# EAGLE design BigEasyDriver (EAGLE 7.7.0)
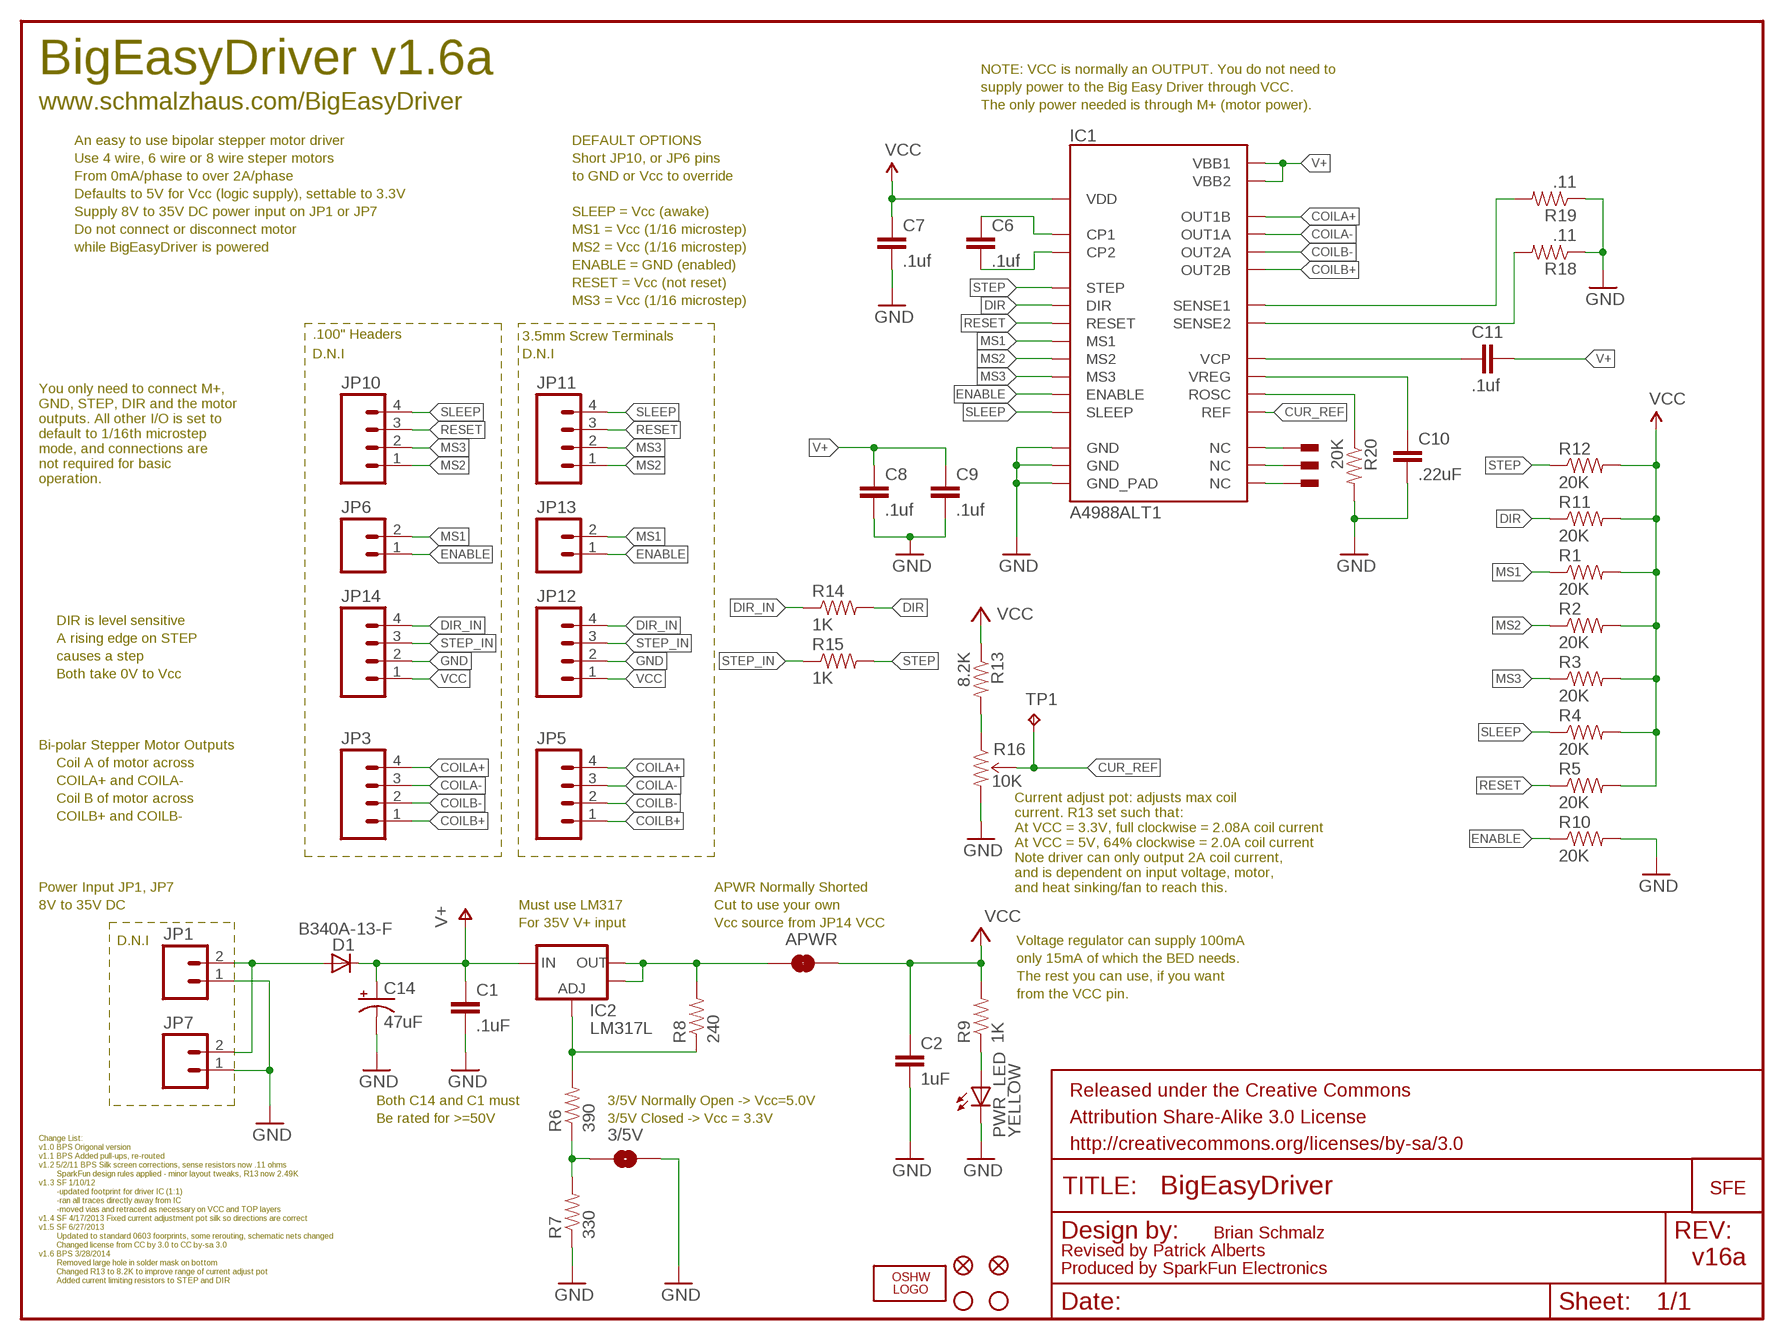
[diagram p0: schematic, sheet 1]

## Parts
3/5V  SOLDERJUMPERNO  [SJ_2S-NO]
APWR  SOLDERJUMPERTRACE  [SJ_2S-TRACE]
C1  .1uF  0.1UF-100V-10%(0603)  [0603-CAP]
C2  1uF  1.0UF-16V-10%(0603)  [0603-CAP]
C6  .1uf  0.1UF-100V-10%(0603)  [0603-CAP]
C7  .1uf  0.1UF-100V-10%(0603)  [0603-CAP]
C8  .1uf  0.1UF-100V-10%(0603)  [0603-CAP]
C9  .1uf  0.1UF-100V-10%(0603)  [0603-CAP]
C10  .22uF  0.22UF50V-20%,+80%(0603)  [0603-CAP]
C11  .1uf  0.1UF-100V-10%(0603)  [0603-CAP]
C14  47uF  47UF-50V-20%(ELECT)  [PANASONIC_D]
D1  B340A-13-F  DIODE-DO-214AC  [DO-214AC]
FID1  FIDUCIAL1X2  [FIDUCIAL-1X2]
FID2  FIDUCIAL1X2  [FIDUCIAL-1X2]
FRAME1  FRAME-LETTER  [CREATIVE_COMMONS]
IC1  A4988ALT1  [QFN-28-5MM_ALT1]
IC2  LM317L  SPARKFUN03_30_09_V_REG_317SOT89SOT89  [SCHMALZHAUS_SOT89]
JP1  M02PTH  [1X02]
JP3  M04PTH  [1X04]
JP5  M04SCREW_LOCK  [SCREWTERMINAL-3.5MM-4_LOCK]
JP6  M02PTH  [1X02]
JP7  M023.5MM_LOCK  [SCREWTERMINAL-3.5MM-2_LOCK]
JP8  STAND-OFF  [STAND-OFF]
JP9  STAND-OFF  [STAND-OFF]
JP10  M04PTH  [1X04]
JP11  M04SCREW_LOCK  [SCREWTERMINAL-3.5MM-4_LOCK]
JP12  M04SCREW_LOCK  [SCREWTERMINAL-3.5MM-4_LOCK]
JP13  M023.5MM_LOCK  [SCREWTERMINAL-3.5MM-2_LOCK]
JP14  M04PTH  [1X04]
LOGO1  OSHW_LOGO_FILLX0100-NT  [OSHW_FILLX100_NOTEXT]
PWR_LED  YELLOW  LED0603  [LED-0603]
R1  20K  20KOHM1/10W5%(0603)  [0603-RES]
R2  20K  20KOHM1/10W5%(0603)  [0603-RES]
R3  20K  20KOHM1/10W5%(0603)  [0603-RES]
R4  20K  20KOHM1/10W5%(0603)  [0603-RES]
R5  20K  20KOHM1/10W5%(0603)  [0603-RES]
R6  390  390OHM1/10W1%(0603)  [0603-RES]
R7  330  330OHM1/10W1%(0603)  [0603-RES]
R8  240  240OHM1/10W1%(0603)  [0603-RES]
R9  1K  1KOHM1/10W1%(0603)  [0603-RES]
R10  20K  20KOHM1/10W5%(0603)  [0603-RES]
R11  20K  20KOHM1/10W5%(0603)  [0603-RES]
R12  20K  20KOHM1/10W5%(0603)  [0603-RES]
R13  8.2K  8.2KOHM-1/10W-5%(0603)  [0603-RES]
R14  1K  1KOHM1/10W1%(0603)  [0603-RES]
R15  1K  1KOHM1/10W1%(0603)  [0603-RES]
R16  10K  TRIMPOT3MM-2  [TRIMPOT-3MM-2]
R18  .11  0.11OHM1/2W1%(2010)  [R2010]
R19  .11  0.11OHM1/2W1%(2010)  [R2010]
R20  20K  20KOHM1/10W5%(0603)  [0603-RES]
TP1  TPPAD1-13  [P1-13]
U$2  LOGO-SFENEW  [SFE-NEW-WEBLOGO]
U$3  PAD  [PAD-0.008]
U$4  PAD  [PAD-0.008]
U$5  PAD  [PAD-0.008]

## Nets
5V_ALT: APWR.1 IC2.OUT IC2.OUT@1(OUT) R8.2
COILA+: IC1.P$21(OUT1B) JP3.4 JP5.4
COILA-: IC1.P$24(OUT1A) JP3.3 JP5.3
COILB+: IC1.P$1(OUT2B) JP3.1 JP5.1
COILB-: IC1.P$26(OUT2A) JP3.2 JP5.2
CUR_REF: IC1.P$17(REF) R16.2(WIPER) TP1.TP
DIR: IC1.P$19(DIR) R11.1 R14.2
DIR_IN: JP12.4 JP14.4 R14.1
ENABLE: IC1.P$2(ENABLE) JP6.1 JP13.1 R10.1
GND: 3/5V.2 C1.2 C2.2 C7.2 C8.2 C9.2 C10.2 C14.- IC1.P$3(GND) IC1.P$18(GND) IC1.P$29(GND_PAD) JP1.1 JP7.1 JP12.2 JP14.2 PWR_LED.C R7.1 R10.2 R16.3(CW) R18.1 R19.1 R20.2
MS1: IC1.P$9(MS1) JP6.2 JP13.2 R1.1
MS2: IC1.P$10(MS2) JP10.1 JP11.1 R2.1
MS3: IC1.P$11(MS3) JP10.2 JP11.2 R3.1
N$1: D1.A JP1.2 JP7.2
N$2: PWR_LED.A R9.1
N$3: R13.2 R16.1(CCW)
N$4: 3/5V.1 R6.1 R7.2
N$5: IC1.P$7(NC) U$3.P$1
N$6: IC2.ADJ R6.2 R8.1
N$7: IC1.P$20(NC) U$4.P$1
N$8: C6.1 IC1.P$4(CP1)
N$9: C6.2 IC1.P$5(CP2)
N$10: IC1.P$25(NC) U$5.P$1
N$19: IC1.P$13(ROSC) R20.1
N$20: C10.1 IC1.P$8(VREG)
N$21: C11.1 IC1.P$6(VCP)
N$31: IC1.P$27(SENSE2) R18.2
N$32: IC1.P$23(SENSE1) R19.2
RESET: IC1.P$12(RESET) JP10.3 JP11.3 R5.1
SLEEP: IC1.P$14(SLEEP) JP10.4 JP11.4 R4.1
STEP: IC1.P$16(STEP) R12.1 R15.2
STEP_IN: JP12.3 JP14.3 R15.1
V+: C1.1 C8.1 C9.1 C11.2 C14.+ D1.C IC1.P$22(VBB1) IC1.P$28(VBB2) IC2.IN
VCC: APWR.2 C2.1 C7.1 IC1.P$15(VDD) JP12.1 JP14.1 R1.2 R2.2 R3.2 R4.2 R5.2 R9.2 R11.2 R12.2 R13.1

## Notes on the sheet
- BigEasyDriver v1.6a | NOTE: VCC is normally an OUTPUT. You do not need to
- supply power to the Big Easy Driver through VCC.
- www.schmalzhaus.com/BigEasyDriver | The only power needed is through M+ (motor power).
- An easy to use bipolar stepper motor driver | DEFAULT OPTIONS
- Use 4 wire, 6 wire or 8 wire steper motors | Short JP10, or JP6 pins
- From 0mA/phase to over 2A/phase | to GND or Vcc to override
- Defaults to 5V for Vcc (logic supply), settable to 3.3V
- Supply 8V to 35V DC power input on JP1 or JP7 | SLEEP = Vcc (awake)
- Do not connect or disconnect motor | MS1 = Vcc (1/16 microstep)
- while BigEasyDriver is powered | MS2 = Vcc (1/16 microstep)
- ENABLE = GND (enabled)
- RESET = Vcc (not reset)
- MS3 = Vcc (1/16 microstep)
- .100" Headers | 3.5mm Screw Terminals
- D.N.I | D.N.I
- You only need to connect M+, 
  GND, STEP, DIR and the motor 
  outputs. All other I/O is set to 
  default to 1/16th microstep 
  mode, and connections are 
  not required for basic 
  operation.
- DIR is level sensitive
- A rising edge on STEP
- causes a step
- Both take 0V to Vcc
- Bi-polar Stepper Motor Outputs
- Coil A of motor across
- COILA+ and COILA-
- Coil B of motor across
- COILB+ and COILB-
- Power Input JP1, JP7 | APWR Normally Shorted
- Current adjust pot: adjusts max coil
  current. R13 set such that:
  At VCC = 3.3V, full clockwise = 2.08A coil current
  At VCC = 5V, 64% clockwise = 2.0A coil current
  Note driver can only output 2A coil current,
  and is dependent on input voltage, motor,
  and heat sinking/fan to reach this.
- 8V to 35V DC | Must use LM317 | Cut to use your own
- For 35V V+ input | Vcc source from JP14 VCC
- D.N.I | Voltage regulator can supply 100mA
- only 15mA of which the BED needs.
- The rest you can use, if you want
- from the VCC pin.
- Both C14 and C1 must | 3/5V Normally Open -> Vcc=5.0V
- Be rated for >=50V | 3/5V Closed -> Vcc = 3.3V
- Change List:
- v1.0 BPS Origonal version
- v1.1 BPS Added pull-ups, re-routed
- v1.2 5/2/11 BPS Silk screen corrections, sense resistors now .11 ohms
- SparkFun design rules applied - minor layout tweaks, R13 now 2.49K
- v1.3 SF 1/10/12
- -updated footprint for driver IC (1:1)
- -ran all traces directly away from IC
- -moved vias and retraced as necessary on VCC and TOP layers
- v1.4 SF 4/17/2013 Fixed current adjustment pot silk so directions are correct
- v1.5 SF 6/27/2013
- Updated to standard 0603 foorprints, some rerouting, schematic nets changed | Brian Schmalz
- Changed license from CC by 3.0 to CC by-sa 3.0
- v1.6 BPS 3/28/2014 | Revised by Patrick Alberts
- Removed large hole in solder mask on bottom | v16a
- Changed R13 to 8.2K to improve range of current adjust pot | Produced by SparkFun Electronics
- Added current limiting resistors to STEP and DIR

## Library data of the parts
3/5V APWR = SparkFun03_30_09:SOLDERJUMPER: Solder Jumper Standard SMD solder jumper. Used to automate production. Two varients : Normally Open and Normally Closed are the same, but have different paste layers. NC will have a large amount of paste and should jumper during reflow.
C1 C6-C9 C11 = SparkFun-Capacitors:0.1UF-100V-10%(0603): CAP-08390; PROD_ID: CAP-08390; VALUE: 0.1uF
C2 = SparkFun-Capacitors:1.0UF-16V-10%(0603): CAP-00868; PROD_ID: CAP-00868; VALUE: 1.0uF
C10 = SparkFun-Capacitors:0.22UF50V-20%,+80%(0603): CAP-09885; PROD_ID: CAP-09885; VALUE: 0.22uF
C14 = SparkFun-Capacitors:47UF-50V-20%(ELECT): CAP-10547; PROD_ID: CAP-10547
D1 = diode:DIODE-: DIODE
FID1 FID2 = SparkFun-Aesthetics:FIDUCIAL: Fiducial Alignment Points Various fiducial points for machine vision alignment.
FRAME1 = SparkFun-Aesthetics:FRAME-LETTER: Schematic Frame Standard 8.5x11 US Letter frame
IC1 = SparkFun-PowerIC:A4988: DMOS Microstepping Driver with Translator; PROD_ID: IC-11483
IC2 = BigEasyDriver_v11:SPARKFUN03_30_09_V_REG_317: Voltage Regulator Standard LM317 adjustable voltage regulator. AOI (Adjust Output Input). Google LM317 Calculator' for easy to use app to get the two resistor values needed. 240/720 for 5V output. 240/390 for 3.3V output. Spark Fun Electronics SKU : COM-00527'
JP1 JP6 = SparkFun:M02: Header 2 Standard 2-pin 0.1" header. Use with straight break away headers (SKU : PRT-00116), right angle break away headers (PRT-00553), swiss pins (PRT-00743), machine pins (PRT-00117), and female headers (PRT-00115). Molex polarized connector foot print use with SKU : PRT-08233 with associated crimp pins and housings.
JP3 JP10 JP14 = SparkFun:M04: Header 4 Standard 4-pin 0.1" header. Use with straight break away headers (SKU : PRT-00116), right angle break away headers (PRT-00553), swiss pins (PRT-00743), machine pins (PRT-00117), and female headers (PRT-00115). Molex polarized connector foot print use with SKU : PRT-08231 with associated ...
JP5 JP11 JP12 = BigEasyDriver_v11:M04: Header 4 Standard 4-pin 0.1" header. Use with straight break away headers (SKU : PRT-00116), right angle break away headers (PRT-00553), swiss pins (PRT-00743), machine pins (PRT-00117), and female headers (PRT-00115). Molex polarized connector foot print use with SKU : PRT-08231 with associated ...
JP7 JP13 = BigEasyDriver_v11:M02: Header 2 Standard 2-pin 0.1" header. Use with straight break away headers (SKU : PRT-00116), right angle break away headers (PRT-00553), swiss pins (PRT-00743), machine pins (PRT-00117), and female headers (PRT-00115). Molex polarized connector foot print use with SKU : PRT-08233 with associated crimp pins and housings.
JP8 JP9 = SparkFun-7-28-09:STAND-OFF: Stand Off This is the mechanical footprint for a #4 phillips button head screw. Use the keepout ring to avoid running the screw head into surrounding components. SKU : PRT-00447
LOGO1 = OSHW:OSHW_LOGO_FILL
PWR_LED = SparkFun03_30_09:LED: LEDs Standard schematic elements and footprints for 5mm, 3mm, 1206, and 0603 sized LEDs. 5mm - Spark Fun Electronics SKU : COM-00529 (and others)
R1-R5 R10-R12 R20 = SparkFun-Resistors:20KOHM1/10W5%(0603): RES-09231; PROD_ID: RES-09231
R6 = SparkFun-Resistors:390OHM1/10W1%(0603): RES-07864; PROD_ID: RES-07864
R7 = SparkFun-Resistors:330OHM1/10W1%(0603): RES-00818; PROD_ID: RES-00818
R8 = SparkFun-Resistors:240OHM1/10W1%(0603): RES-07849; PROD_ID: RES-07849
R9 R14 R15 = SparkFun-Resistors:1KOHM1/10W1%(0603): RES-07856; PROD_ID: RES-07856
R13 = SparkFun-Resistors:8.2KOHM-1/10W-5%(0603): RES-10646; PROD_ID: RES-10646
R16 = SparkFun-Electromechanical:TRIMPOT: Various small potentiometers for "set-and-forget" applications
R18 R19 = SparkFun-Resistors:0.11OHM1/2W1%(2010): RES-08354; PROD_ID: RES-08354
TP1 = testpad:TP: Test pad
U$2 = SparkFun:LOGO-SFE: Spark Fun Electronics PCB Logo This is the standard Spark Fun Electronics PCB logo.
U$3-U$5 = Testing:PAD

## Board
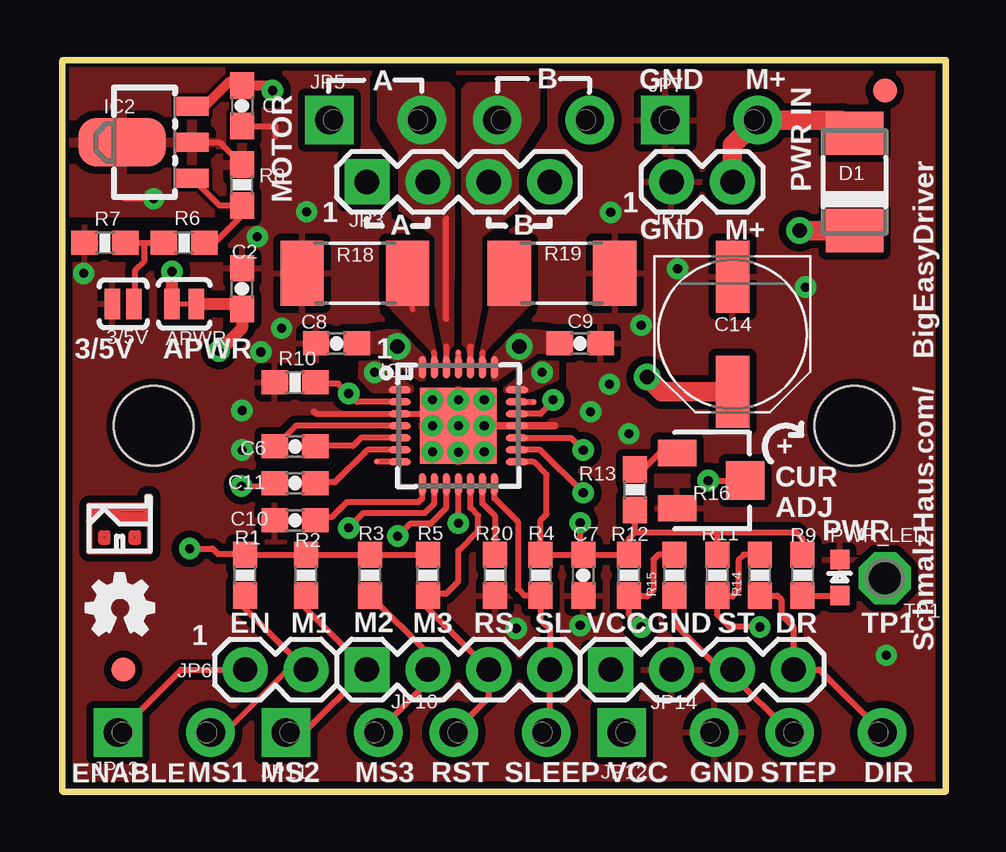
[diagram p1: board, top side]
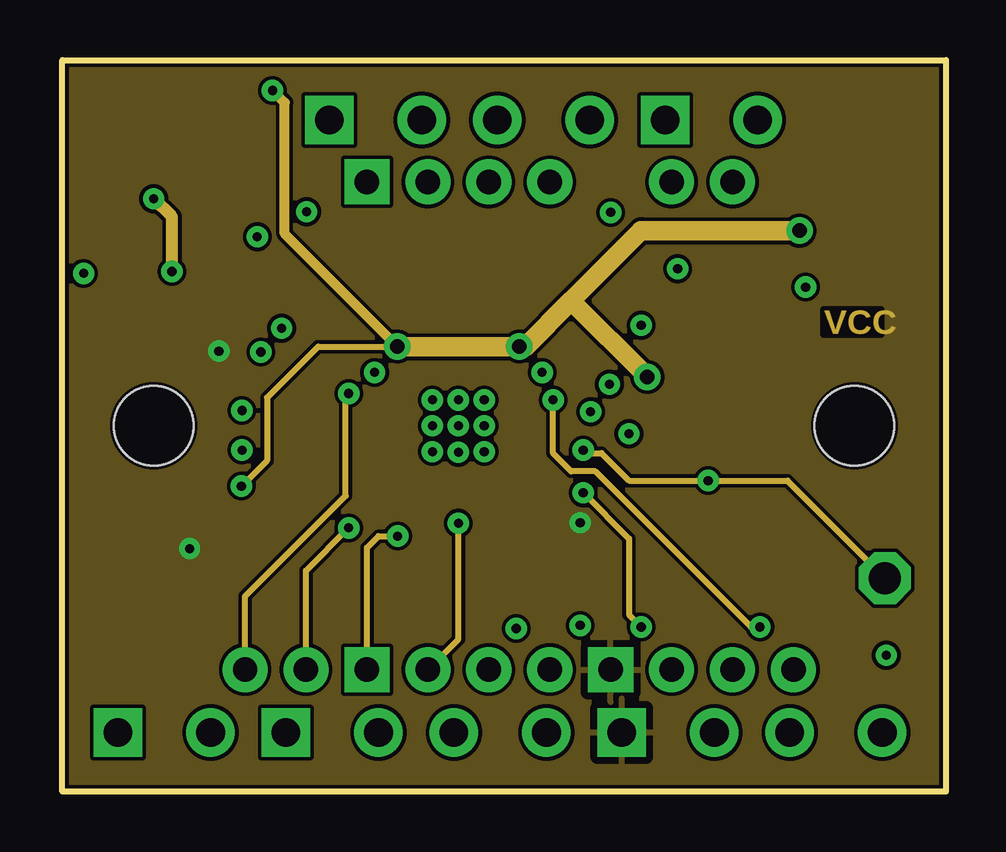
[diagram p2: board, inner layer VCC]
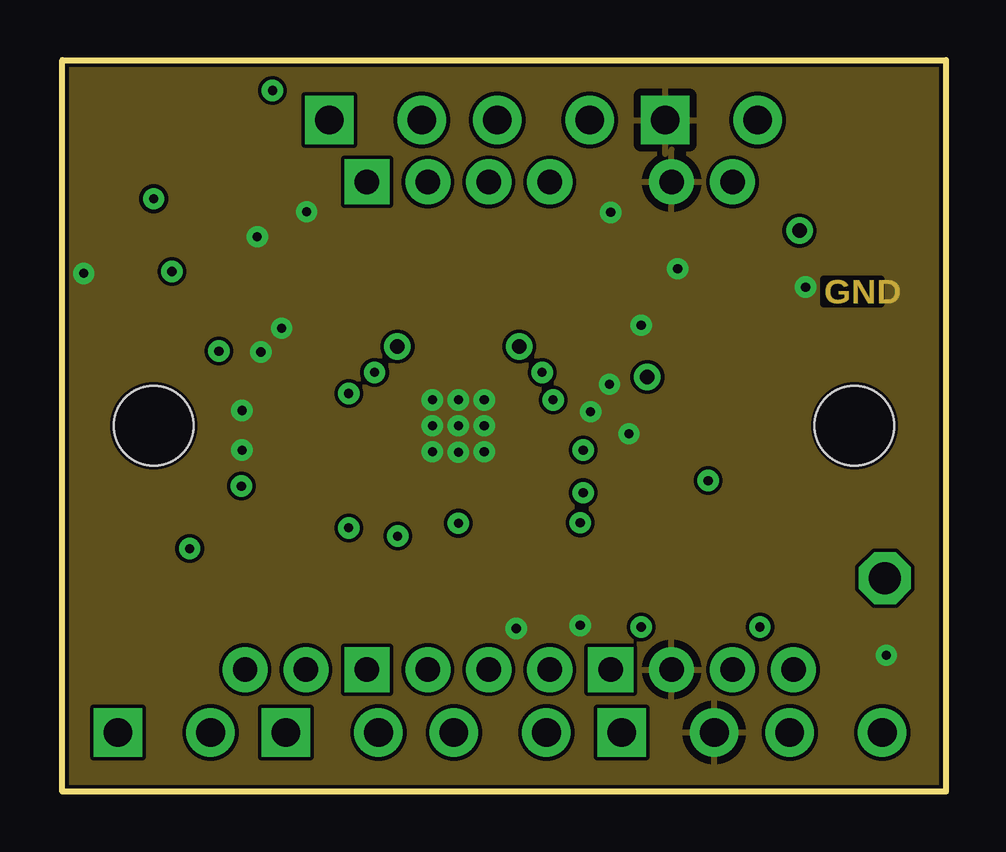
[diagram p3: board, inner layer GND]
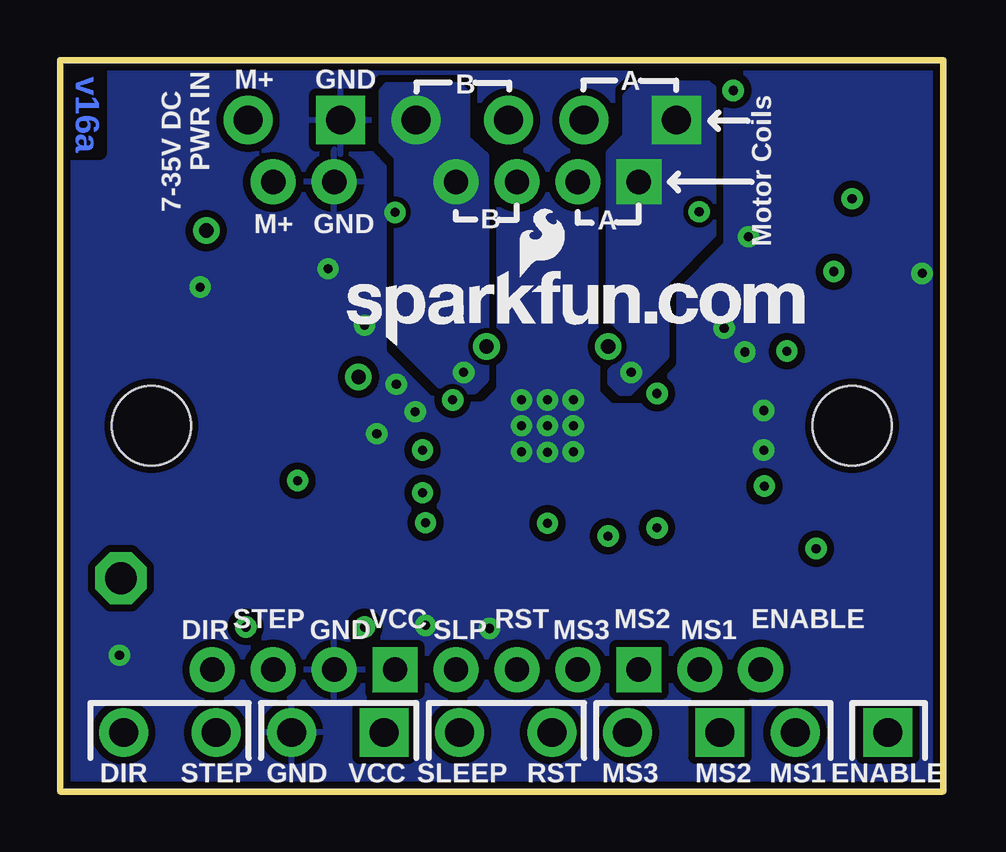
[diagram p4: board, bottom side, seen from below]

Size 36.83 x 30.48 mm. Coordinates in mm from the lower left corner, seen from the top.
Outline: 0,30.48 36.83,30.48 36.83,0 0,0 0,30.48
Copper layers (1*2*15*16): Top 0.035mm / dielectric 1.5mm / VCC 0.035mm / dielectric 0.15mm / GND 0.035mm / dielectric 0.2mm / Bottom 0.035mm
Design rules "SparkFun-4-layer": minimum track width 6mil, minimum drill 13mil, track to track 6mil, track to pad 6mil, pad to pad 6mil, via to via 6mil, smd to smd 6mil, copper to edge 6mil, drill to drill 8mil, minimum pad ring 12mil, minimum via ring 10mil, stop-mask expansion 4mil, vias tented up to drill 20mil, thermal gap 12mil

### Footprints (pad centres in the part's own frame; a part is rotated, then mirrored left to right if it is on the bottom)
SJ_2S-NO = smd 0.635 x 1.27: 1 -0.45,0; 2 0.45,0
SJ_2S-TRACE = smd 0.635 x 1.27: 1 -0.508,0; 2 0.508,0
0603-CAP = smd 1.1 x 1: 1 -0.85,0; 2 0.85,0
PANASONIC_D = smd 3 x 1.4: + 2.4,0; - -2.4,0
DO-214AC = smd 1.8 x 2.4: A 2.025,0; C -2.025,0
FIDUCIAL-1X2 = smd 1 x 1: 1 0,0
QFN-28-5MM_ALT1 = smd 0.94 x 0.3: P$1 -2.44,1.5; P$2 -2.44,1; P$3 -2.44,0.5; P$4 -2.44,0; P$5 -2.44,-0.5; P$6 -2.44,-1; P$7 -2.44,-1.5; P$15 2.44,-1.5; P$16 2.44,-1; P$17 2.44,-0.5; P$18 2.44,0; P$19 2.44,0.5; P$20 2.44,1; P$21 2.44,1.5 | smd 0.3 x 0.94: P$8 -1.5,-2.44; P$9 -1,-2.44; P$10 -0.5,-2.44; P$11 0,-2.44; P$12 0.5,-2.44; P$13 1,-2.44; P$14 1.5,-2.44; P$22 1.5,2.44; P$23 1,2.44; P$24 0.5,2.44; P$25 0,2.44; P$26 -0.5,2.44; P$27 -1,2.44; P$28 -1.5,2.44 | smd 3.175 x 3.175: P$29 0,0
SCHMALZHAUS_SOT89 = smd 0.8 x 1.4: ADJ -1.499,-1.981; IN 1.499,-1.981; OUT 0,-1.98 | smd 2.032 x 3.65: OUT@1 0,0.94
1X02 = drill 1.016 pad 1.88: 1 0,0; 2 2.54,0
1X04 = drill 1.016 pad 1.88 square: 1 0,0 | drill 1.016 pad 1.88: 2 2.54,0; 3 5.08,0; 4 7.62,0
SCREWTERMINAL-3.5MM-4_LOCK = drill 1.2 pad 2.032 square: 1 -0.178,0 | drill 1.2 pad 2.032: 2 3.678,0; 3 6.822,0; 4 10.678,0
SCREWTERMINAL-3.5MM-2_LOCK = drill 1.2 pad 2.032 square: 1 -0.178,0 | drill 1.2 pad 2.032: 2 3.678,0
STAND-OFF = hole 3.302: 0,0
LED-0603 = smd 0.8 x 0.8: A 0,-0.75; C 0,0.75
0603-RES = smd 1.1 x 1: 1 -0.85,0; 2 0.85,0
TRIMPOT-3MM-2 = smd 1.092 x 1.6: 1 -1.155,-1.421; 3 1.155,-1.421 | smd 1.6 x 1.6: 2 0,1.421
R2010 = smd 1.8 x 2.7: 1 -2.2,0; 2 2.2,0
P1-13 = drill 1.321 pad 2.159 octagon: TP 0,0
PAD-0.008 = smd 0.203 x 0.203: P$1 0,0

### Placement (x,y rotation side)
3/5V  2.54,20.32 180 top
APWR  5.08,20.32 0 top
C1  7.49,28.57 270 top
C2  7.49,20.95 90 top
C6  9.7,14.38 0 top
C7  21.72,9.02 270 top
C8  11.43,18.67 180 top
C9  21.59,18.67 0 top
C10  9.7,11.3 180 top
C11  9.7,12.85 180 top
C14  27.94,19.05 270 top
D1  33.02,25.4 90 top
FID1  2.54,5.08 0 top
FID2  34.29,29.21 0 top
FRAME1  -11.78,-11.43 0 top  (outside the outline)
IC1  16.51,15.24 0 top
IC2  3.43,27.05 90 top
JP1  25.4,25.4 0 top
JP3  12.7,25.4 0 top
JP5  11.31,27.98 0 top
JP6  7.62,5.08 0 top
JP7  25.31,27.98 0 top
JP8  3.81,15.24 0 top
JP9  33.02,15.24 0 top
JP10  12.7,5.08 0 top
JP11  9.5,2.46 0 top
JP12  23.5,2.46 0 top
JP13  2.5,2.46 0 top
JP14  22.86,5.08 0 top
LOGO1  0.99,6.53 0 top
PWR_LED  32.41,8.92 0 top
R1  7.62,9.02 90 top
R2  10.16,9.02 90 top
R3  12.83,9.02 90 top
R4  19.94,9.02 90 top
R5  15.24,9.02 90 top
R6  5.08,22.86 0 top
R7  1.78,22.86 0 top
R8  7.49,25.27 90 top
R9  30.86,9.02 90 top
R10  9.7,17.04 180 top
R11  27.3,9.02 90 top
R12  23.62,9.02 90 top
R13  23.88,12.57 90 top
R14  29.08,9.02 90 top
R15  25.53,9.02 90 top
R16  27.05,12.95 270 top
R18  12.19,21.59 0 top
R19  20.83,21.59 180 top
R20  18.03,9.02 270 top
TP1  34.29,8.89 0 top
U$1  [SCHMALZHAUS_SMALL]  2.39,10.01 0 top
U$2  24.87,18.57 0 bottom
U$3  13.11,13.74 0 top
U$4  19.66,16.23 0 top
U$5  16.51,18.29 0 top

### Tracks (layer width: path | path; a pad name or v marks a point on that pad's centre or on a via)
5V_ALT  (via drill 0.38)
  Top 0.254: v3.81,24.7 2.6,24.7 2.54,24.77 | IC2.OUT 6.57,27.05 R8.2
  Top 0.508: APWR.1 v4.57,21.67
  VCC 0.508: v4.57,21.67 4.57,23.94 v3.81,24.7
  pour Top: 7.62,30.48 0,30.48 0,24.13 7.62,24.13
COILA+  (via drill 0.38)
  other vias: 20,17.46
  pour Bottom (isolate 0.203, no thermals): 19.05,17.78 19.05,17.14 19.56,16.64 20.76,16.64 22.8,18.67 22.8,26.42 23.43,27.05 23.43,29.21 23.18,29.49 20.13,29.46 19.84,29.1 19.84,27.24 19.05,26.53 19.05,17.84 19.11,17.78
  pour Top (isolate 0.203, no thermals): 18.47,16.79 18.47,16.69 19.46,16.71 20.62,17.22 20.62,17.86 19.89,17.86
COILA-
  Top 0.254: IC1.P$24 17.01,18.53 17.02,18.54
  pour Top (isolate 0.203, no thermals): 16.94,29.48 19.81,29.48 19.81,27.97 18.92,26.54 18.92,24.26 17.4,23.11 17.4,20.24 17.04,18.34 17.04,18.21 16.97,18.21 16.97,18.34 16.76,18.59 16.74,29.24
COILB+  (via drill 0.38)
  other vias: 13.02,17.46
  pour Top (isolate 0.203, no thermals): 12.42,17.86 12.42,17.25 12.94,16.7 14.57,16.7 14.57,16.83 13.21,17.86
  pour Bottom (isolate 0.203, no thermals): 9.59,29.35 9.59,23.18 11.56,21.21 11.56,18.1 13.08,16.57 13.46,16.57 13.91,17.02 13.91,17.53 13.21,18.22 13.21,18.99 13.97,19.75 13.97,26.63 13.27,27.33 13.27,28.99 12.74,29.53 9.8,29.54
COILB-
  Top 0.254: 16,19.68 16,23.88 | IC1.P$26 16.01,18.53 16,18.54
  pour Top (isolate 0.203, no thermals): 16.1,29.46 13.21,29.46 13.21,27.94 14.1,26.54 14.1,24.26 15.62,23.11 15.62,20.27 15.98,18.39 15.98,18.19 16.05,18.19 16.05,18.34 16.26,18.59 16.28,29.24
CUR_REF  (via drill 0.38)
  Top 0.254: v26.92,12.95 R16.2 | IC1.P$17 21.2,14.74 v21.72,14.22
  VCC 0.254: TP1.TP 30.23,12.95 v26.92,12.95 23.62,12.95 22.48,14.1 21.84,14.1 v21.72,14.22
DIR  (via drill 0.38)
  Top 0.254: IC1.P$19 19.93,15.74 20.46,16.27 v20.46,16.32 | R14.2 28.41,9.87 28.19,9.65 28.19,8.38 27.94,8.13 27.34,8.13 R11.1 27.3,7.37 27.81,6.86 v29.08,6.86
  VCC 0.254: v20.46,16.32 20.46,14.08 21.21,13.34 22.23,13.34 28.7,6.86 v29.08,6.86
DIR_IN
  Top 0.254: R14.1 29.81,8.17 29.97,8 29.97,7.37 30.48,6.86 JP14.4 31.56,5.08 JP12.4
ENABLE  (via drill 0.38)
  Top 0.254: JP13.1 2.32,2.45 4.95,5.08 JP6.1 | R10.1 10.6,16.99 11.51,16.99 11.91,16.59 v11.94,16.59 12.28,16.24 IC1.P$2
  VCC 0.254: JP6.1 7.62,8.13 11.81,12.32 11.81,16.46 v11.94,16.59
GND  (via drill 0.38)
  Top 0.254: 15.3,15.75 15.3,15.74 | 8.89,27.3 8.88,27.29 8.88,27.73 C1.2 | 15.3,15.75 15.3,15.37 v15.43,15.24 15.43,15.74 IC1.P$3 | 15.3,15.75 15.3,15.77 | 10.49,15.82 10.57,15.75 14.22,15.75
  Top 0.305: v17.59,15.24 IC1.P$18 20.51,15.24
  other vias: 15.43,16.32 16.51,16.32 17.59,16.32 16.51,15.24 15.43,14.16 16.51,14.14 17.59,14.16 22.81,16.97 30.99,21.02 25.65,21.78 8.13,23.11 0.89,21.59 18.92,6.79 21.59,6.92 34.35,5.68 8.28,18.31 7.49,15.88 24.13,19.43 10.19,24.16 9.14,19.3 7.49,14.22 22.02,15.82 23.62,14.91 22.86,24.13
  pour Top (isolate 0.305, rank 3): 0,30.48 36.83,30.48 36.83,0 0,0
  pour Bottom (isolate 0.305, rank 3): 0,30.48 36.83,30.48 36.83,0 0,0
  pour GND: 0,30.48 36.83,30.48 36.83,0 0,0
MS1  (via drill 0.38)
  Top 0.203: 6.78,2.46 9.4,5.08
  Top 0.254: R1.1 7.62,7.62 JP6.2 9.4,5.08 | JP13.2 6.78,2.46 | IC1.P$9 15.51,12.01 15.11,11.61 12.56,11.61 v11.94,10.99
  VCC 0.254: JP6.2 10.16,9.21 v11.94,10.99
MS2  (via drill 0.38)
  Top 0.254: JP11.1 10.08,2.46 JP10.1 10.16,7.62 R2.1 | IC1.P$10 16.01,11.81 16,11.81 15.34,11.15 14.49,11.15 v13.98,10.64 14.19,10.85
  VCC 0.254: JP10.1 12.7,10.16 13.18,10.64 v13.98,10.64
MS3  (via drill 0.38)
  Top 0.254: JP11.2 13.18,2.51 15.24,4.57 JP10.2 15.24,5.75 R3.1 | v16.51,11.18 IC1.P$11
  VCC 0.254: v16.51,11.18 16.51,6.35 JP10.2
N$1
  Top 0.813: D1.A 32.47,27.98 JP7.2 27.94,26.93 JP1.2
N$2
  Top 0.254: R9.1 PWR_LED.A
N$3
  Top 0.254: R13.2 24.22,13.42 24.89,14.1 25.62,14.1 R16.1
N$4
  Top 0.254: 3/5V.1 3.05,20.32 3.05,21.72 3.43,22.1 3.43,22.86 | R7.2 3.43,22.86 | 3.43,22.86 R6.1
N$5
  Top 0.254: IC1.P$7 U$3.P$1
N$6
  Top 0.254: R6.2 6.35,22.86 7.49,24 R8.1 6.54,24.42 IC2.ADJ
N$7
  Top 0.254: IC1.P$20 U$4.P$1
N$8
  Top 0.254: IC1.P$4 9.72,15.24 C6.1
N$9
  Top 0.254: IC1.P$5 12.45,14.74 12.12,14.4 10.58,14.4 C6.2
N$10
  Top 0.254: IC1.P$25 U$5.P$1
N$19
  Top 0.254: IC1.P$13 17.51,12.01 18.03,11.48 R20.1
N$20
  Top 0.254: IC1.P$8 15.01,12.22 14.86,12.06 11.86,12.06 11.23,11.43 10.68,11.43 C10.1
N$21
  Top 0.254: IC1.P$6 12.72,14.24 11.35,12.88 10.58,12.88 C11.1
N$31
  Top 0.203: 14.61,20.07 14.61,21.3
  Top 0.254: R18.2 13.97,21.59 | IC1.P$27 15.51,18.27 15.49,18.29
  pour Top (isolate 0.203, no thermals): 13.59,20.32 15.48,18.34 15.48,18.17 15.54,18.2 15.11,20.32
N$32
  Top 0.254: IC1.P$23 17.51,18.27 17.53,18.29
  pour Top (isolate 0.203, no thermals): 17.48,18.21 17.55,18.21 17.55,18.36 19.43,20.32 17.91,20.32
RESET
  Top 0.254: JP11.3 16.32,2.48 17.78,3.94 JP10.3 15.24,7.62 R5.1 15.31,8.24 15.99,8.24 16.51,8.76 16.51,10.03 17.34,10.86 17.34,11.49 17.01,11.82 IC1.P$12
SLEEP
  Top 0.254: JP11.4 20.32,2.6 JP10.4 20.32,6.73 19.94,7.11 R4.1 19.27,8.17 18.99,8.45 18.99,11.24 18.01,12.22 IC1.P$14
STEP  (via drill 0.38)
  Top 0.254: IC1.P$16 19.92,14.24 v21.72,12.45 | R15.2 24.85,9.87 24.64,9.65 24.64,8.38 24.38,8.13 23.66,8.13 R12.1 23.62,7.37 v24.13,6.86
  VCC 0.254: v21.72,12.45 23.62,10.54 23.62,7.37 v24.13,6.86
STEP_IN
  Top 0.254: R15.1 25.53,6.99 27.43,5.08 JP14.3 27.94,4.84 JP12.3
V+  (via drill 0.38, 0.6)
  Top 0.203: IC1.P$28 15.01,18.01
  Top 0.254: IC1.P$22 18.01,18.01 | v7.47,12.72 8.73,12.72 C11.2
  Top 0.406: 8.76,29.08 v8.76,29.21 8.55,29.43 C1.1 7.33,29.59 6.99,29.59 5.94,28.55 IC2.IN
  Top 0.813: D1.C v30.74,23.38 v30.73,23.37 | C14.+ 25.01,16.65 v24.38,17.27
  VCC 0.254: v13.97,18.54 10.67,18.54 8.53,16.41 8.53,13.79 v7.47,12.72
  VCC 0.406: v8.76,29.21 9.27,28.7 9.27,23.24 v13.97,18.54
  VCC 0.813: v30.73,23.37 24.13,23.37 21.21,20.45 | 21.21,20.45 19.3,18.54 v19.05,18.54 v13.97,18.54 | 21.21,20.45 v24.38,17.27
  pour Top (isolate 0.203, no thermals): 12.37,18.31 12.37,19 13.46,19.18 13.97,19.18 15.06,18.07 15.06,17.18 14.9,17.18 13.36,18.31
  pour Top (isolate 0.203, no thermals): 18.03,18.16 19.05,19.18 19.81,19.18 20.6,19.05 20.6,18.29 19.79,18.31 18.11,17.17 17.98,17.17
VCC  (via drill 0.38)
  Top 0.254: 23.88,10.79 27.3,10.79 | R5.2 R3.2 R2.2 R1.2 7.58,9.91 6.48,9.91 6.26,10.12 v5.31,10.12 | 21.59,9.87 R4.2 19.94,11.3 20.19,11.56 20.19,13.21 19.66,13.74 IC1.P$15 | 21.59,9.87 C7.1 R12.2 23.62,10.54 23.88,10.79 | R11.2 27.3,10.79 | 27.3,10.79 30.61,10.79 30.86,10.54 R9.2 | v21.59,11.2 21.59,9.87 | 23.88,10.79 R13.1
  Top 0.508: APWR.2 7.28,20.32 C2.1 7.49,19.32 v6.53,18.35
  pour VCC: 0,30.48 36.83,30.48 36.83,0 0,0

### Text on the board
VCC: VCC
GND: GND
Bottom: v16a
tPlace: A | B | GND | M+ | MOTOR | PWR IN | 1 | 1 | A | B | GND | M+ | 3/5V | APWR | 1 | BigEasyDriver | + | CUR | ADJ | PWR | EN | M1 | M2 | M3 | RS | SL | VCC | GND | ST | DR | TP1 | 1 | SchmalzHaus.com/ | ENABLE | MS1 | MS2 | MS3 | RST | SLEEP | VCC | GND | STEP | DIR
bPlace: A | B | GND | M+ | PWR IN | 7-35V DC | Motor Coils | A | B | GND | M+ | ENABLE | MS2 | RST | VCC | STEP | MS1 | MS3 | SLP | GND | DIR | ENABLE | MS1 | MS2 | MS3 | RST | SLEEP | VCC | GND | STEP | DIR
tValues: Brian Schmalz: http://schmalzhaus.com/BigEasyDriver/index.html
tDocu: THIS IS A 4-LAYER BOARD. | Revised by: Patrick Alberts/Toni Klopfenstein | Produced by SparkFun Electronics